# EAGLE design wifiboard (EAGLE 7.5.0)
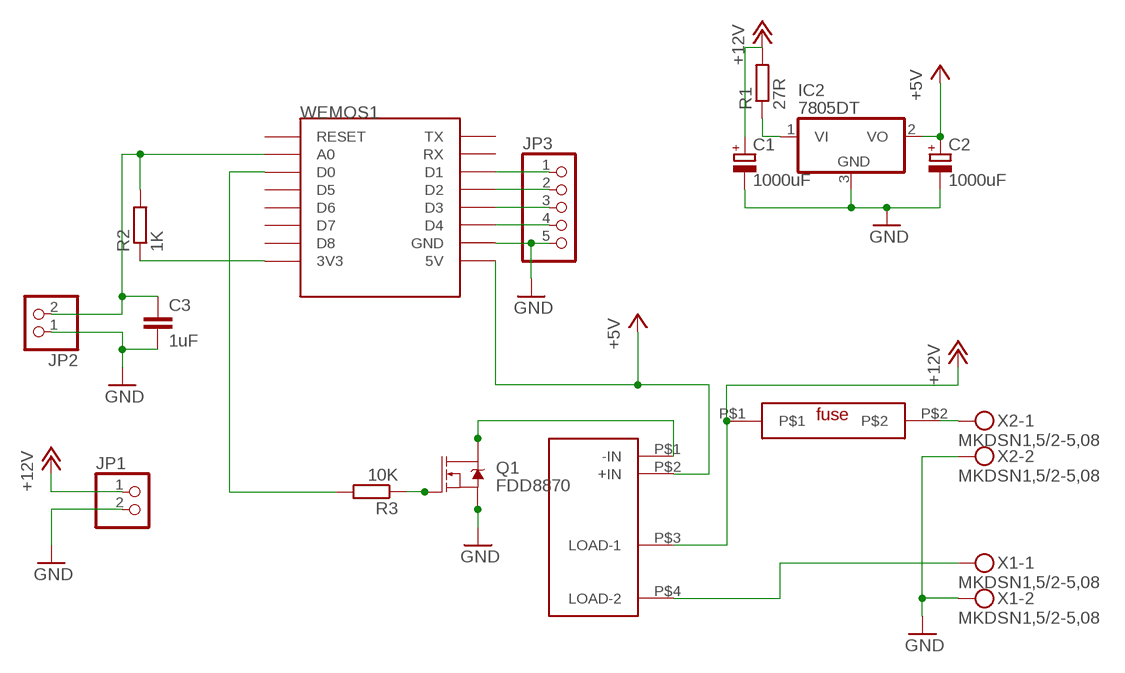
[diagram p0: schematic, sheet 1]

## Parts
C1  1000uF  CPOL-EUB45181B  [B45181B]
C2  1000uF  CPOL-EUB45181B  [B45181B]
C3  1uF  C-EUC0805  [C0805]
IC2  7805DT  [TO252]
JP1  PINHD-1X2  [1X02]
JP2  PINHD-1X2  [1X02]
JP3  PINHD-1X5  [1X05]
Q1  FDD8870  MOSFET-NCH-FDD8780  [DPAK]
R1  27R  R-EU_0207/10  [0207/10]
R2  1K  R-EU_M0805  [M0805]
R3  10K  R-EU_M0805  [M0805]
U$1  OMRON-G6DS  [OMRON-G6DS-1A-H]
U$2  FUSE  [FUSE]
WEMOS1  WEMOS-D1-MINI  [WEMOS-D1-MINI]
X1  MKDSN1,5/2-5,08  [MKDSN1,5/2-5,08]
X2  MKDSN1,5/2-5,08  [MKDSN1,5/2-5,08]

## Nets
+5V: C2.+ IC2.2(VO) U$1.P$2(+IN) WEMOS1.5V
+12V: C1.+ JP1.1 R1.2 U$1.P$3(LOAD-1) U$2.P$1
GND: C1.- C2.- C3.2 IC2.3(GND) JP1.2 JP2.1 JP3.5 Q1.3(S) WEMOS1.GND X1.2 X2.2
N$2: IC2.1(VI) R1.1
N$3: C3.1 JP2.2 R2.2 WEMOS1.A0
N$4: R2.1 WEMOS1.3V3
N$5: Q1.1(G) R3.1
N$6: R3.2 WEMOS1.D0
N$7: Q1.4(D) U$1.P$1(-IN)
N$10: U$1.P$4(LOAD-2) X1.1
N$11: JP3.4 WEMOS1.D4
N$12: U$2.P$2 X2.1
N$13: JP3.3 WEMOS1.D3
N$14: JP3.2 WEMOS1.D2
N$15: JP3.1 WEMOS1.D1
Unconnected: WEMOS1.D5 WEMOS1.D6 WEMOS1.D7 WEMOS1.D8 WEMOS1.RESET WEMOS1.RX WEMOS1.TX

## Library data of the parts
C1 C2 = rcl:CPOL-EU: POLARIZED CAPACITOR, European symbol
C3 = rcl:C-EU: CAPACITOR, European symbol
IC2 = adafruit:78*: Positive VOLTAGE REGULATOR Added bigger pads to the TO-92 package
JP1 JP2 = pinhead:PINHD-1X2: PIN HEADER
JP3 = pinhead:PINHD-1X5: PIN HEADER
Q1 = SparkFun-DiscreteSemi:MOSFET-NCH: N-channel MOSFETs Voltage controlled devices that allow control of high current outputs. SparkFun Products: SparkFun OpenScale <https://www.sparkfun.com/products/13261> SparkFun Digital Sandbox <https://www.sparkfun.com/products/12651> SparkFun Monster Moto Shield <https://www.sparkfun.com/products/10182> SparkFun MOSFET Power Controller <https://www.sparkfun.com/products/11214>; PROD_ID: TRANS-09984; VALUE: 35A/25V/8.5mΩ
R1-R3 = rcl:R-EU_: RESISTOR, European symbol
U$1 = alexa:OMRON-G6DS
U$2 = alexa:FUSE
WEMOS1 = esp8266modules:WEMOS-D1-MINI: WeMos.cc D1 mini ESP8266 module
X1 X2 = con-phoenix-508:MKDSN1,5/2-5,08: MKDSN 1,5/ 2-5,08 Printklemme Nennstrom: 13,5 A Nennspannung: 250 V Rastermaß: 5,08 mm Polzahl: 2 Anschlussart: Schraubanschluss Montage: Löten Anschlussrichtung Leiter/Platine: 0 ° Artikelnummer: 1729128 Source: http://eshop.phoenixcontact.com .. 1729128.pdf

## Board
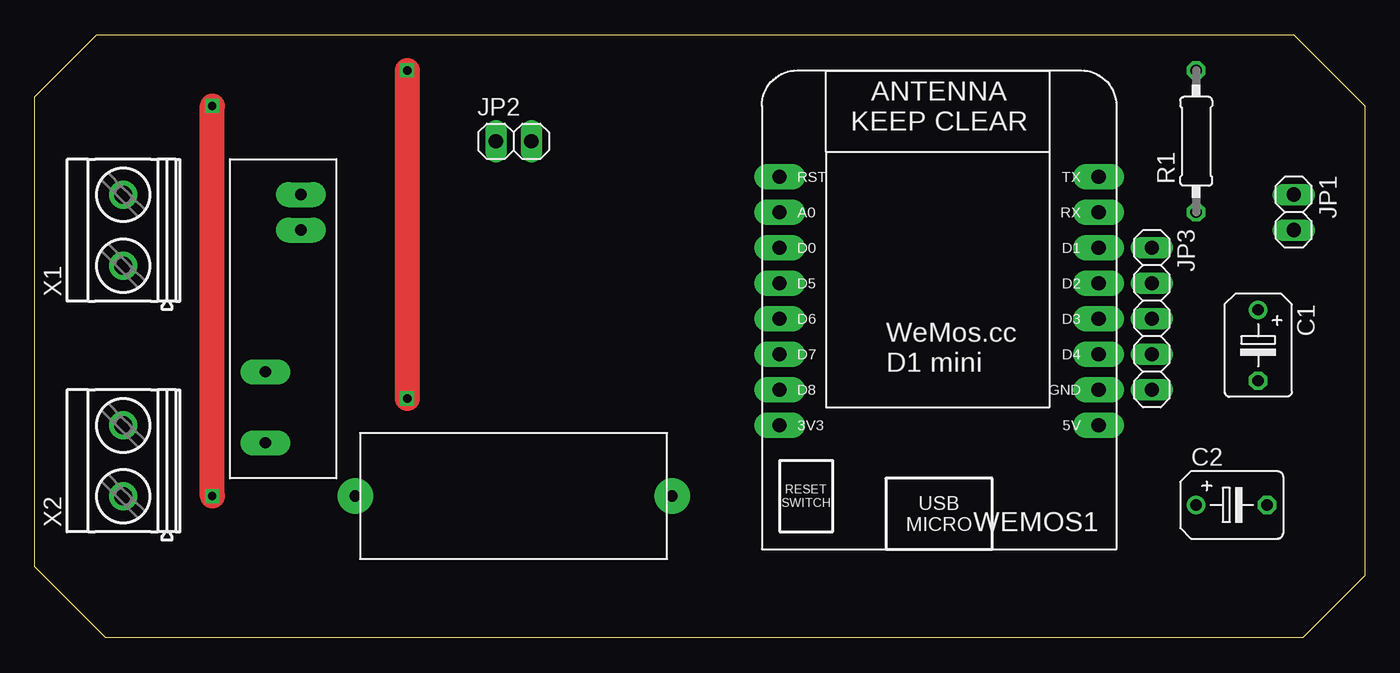
[diagram p1: board, top side]
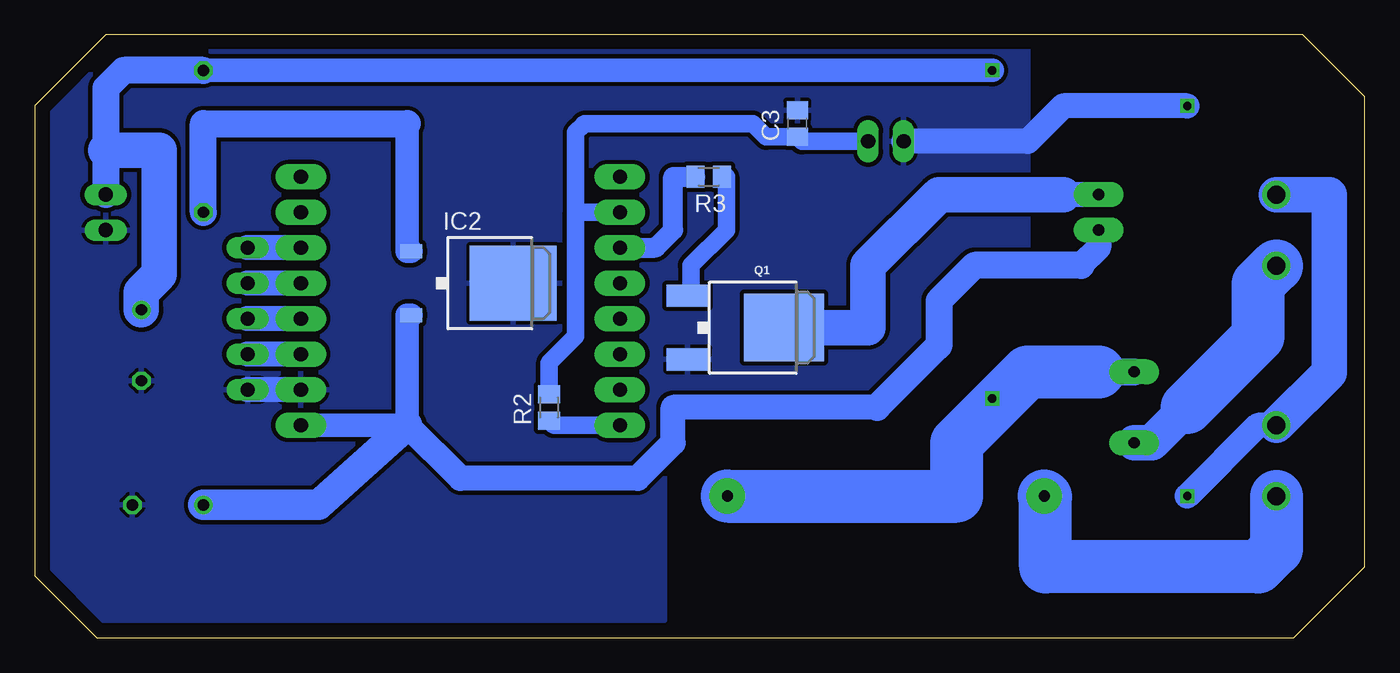
[diagram p2: board, bottom side, seen from below]

Size 95.25 x 43.18 mm. Coordinates in mm from the lower left corner, seen from the top.
Outline: 5.08,0 0,5.08 0,38.74 4.45,43.18 90.17,43.18 95.25,38.1 95.25,4.45 90.81,0 5.08,0
Copper layers (1*16): Top 0.035mm / dielectric 1.5mm / Bottom 0.035mm
Design rules "default *": minimum track width 10mil, minimum drill 24mil, track to track 12mil, track to pad 12mil, pad to pad 12mil, via to via 12mil, smd to smd 8mil, copper to edge 40mil, drill to drill 8mil, minimum pad ring 10mil, minimum via ring 8mil, stop-mask expansion 4mil, vias tented up to drill 0mil, thermal gap 10mil

### Footprints (pad centres in the part's own frame; a part is rotated, then mirrored left to right if it is on the bottom)
B45181B = drill 0.813: + -2.54,0 | drill 0.813 octagon: - 2.54,0
C0805 = smd 1.3 x 1.5: 1 -0.95,0; 2 0.95,0
TO252 = smd 1 x 1.6: 1 -2.28,-4.8; 2 2.28,-4.8 | smd 5.4 x 6.2: 3 0,2.5
1X02 = drill 1.016 long: 1 -1.27,0; 2 1.27,0
1X05 = drill 1.016 long: 1 -5.08,0; 2 -2.54,0; 3 0,0; 4 2.54,0; 5 5.08,0
DPAK = smd 1.6 x 3: 1 -2.28,-5.31; 3 2.28,-5.31 | smd 4.826 x 5.715: 4 0,1.588
0207/10 = drill 0.813 octagon: 1 -5.08,0; 2 5.08,0
M0805 = smd 1.3 x 1.6: 1 -0.95,0; 2 0.95,0
OMRON-G6DS-1A-H = drill 0.8 pad 1.778 long: P$1 0,2.54; P$2 2.54,2.54; P$3 12.7,0; P$4 17.78,0
FUSE = drill 0.8 pad 2.54: P$1 11.35,0; P$2 -11.35,0
WEMOS-D1-MINI = drill 1.016 pad 1.829 long: 3V3 -10.16,-10.16; 5V 12.7,-10.16; A0 -10.16,5.08; D0 -10.16,2.54; D1 12.7,2.54; D2 12.7,0; D3 12.7,-2.54; D4 12.7,-5.08; D5 -10.16,0; D6 -10.16,-2.54; D7 -10.16,-5.08; D8 -10.16,-7.62; GND 12.7,-7.62; RESET -10.16,7.62; RX 12.7,5.08; TX 12.7,7.62
MKDSN1,5/2-5,08 = drill 1.3 pad 2: 1 -2.561,0.025; 2 2.519,0.025

### Placement (x,y rotation side)
C1  87.63,20.95 270 top
C2  85.72,9.53 0 top
C3  40.64,36.83 90 bottom
IC2  63.5,25.4 270 bottom
JP1  90.17,30.48 270 top
JP2  34.29,35.56 0 top
JP3  80.01,22.86 270 top
Q1  43.18,22.22 270 bottom
R1  83.19,35.56 90 top
R2  58.42,16.51 90 bottom
R3  46.99,33.02 180 bottom
U$1  16.51,31.75 270 top
U$2  34.29,10.16 0 top
WEMOS1  63.5,25.4 0 top
X1  6.35,29.21 90 top
X2  6.35,12.7 90 top

### Tracks (layer width: path | path; a pad name or v marks a point on that pad's centre or on a via)
+5V
  Bottom 1.676: WEMOS1.5V 68.58,15.24 68.58,23.12 IC2.2
  Bottom 1.778: 34.92,16.51 49.53,16.51 49.53,13.97 52.07,11.43 64.77,11.43 68.58,15.24 | U$1.P$2 19.05,27.94 20.32,26.67
  Bottom 1.93: 20.32,26.67 27.94,26.67 30.48,24.13 30.48,21.06 arc45 30.55,20.88 34.92,16.51
  Bottom 2.184: C2.+ 74.93,9.53 68.58,15.24
+12V  (via drill 0.6)
  Top 1.778: v26.67,40.64 v26.67,17.14
  Bottom 1.27: v26.67,17.14 26.04,17.14 24.77,18.41
  Bottom 1.676: v26.67,40.64 R1.2
  Bottom 1.93: 19.05,19.05 U$1.P$3 | R1.2 88.8,40.64 arc-45 88.97,40.57 90.17,39.37 90.17,34.93 JP1.1
  Bottom 2.54: C1.+ 87.63,24.77 86.36,26.04 86.36,34.93 90.17,34.93
  Bottom 3.81: U$2.P$1 29.21,10.16 29.21,13.97 24.77,18.41 24.13,19.05 19.05,19.05
GND  (via drill 0.6)
  Top 1.778: v12.7,10.16 v12.7,38.1
  Bottom 1.778: WEMOS1.GND JP3.5 | X2.2 7.64,15.22 v12.7,10.16 | v12.7,38.1 21.59,38.1 24.13,35.56 JP2.1
  Bottom 2.54: X1.2 2.56,31.73 2.54,31.75 2.54,19 X2.2
  pour Bottom: 50.16,1.27 93.98,1.27 93.98,43.18 24.13,43.18 24.13,27.94 26.67,25.4 29.21,24.13 34.29,16.51 50.16,16.51
N$2
  Bottom 1.676: IC2.1 68.58,27.68 68.58,36.83
  Bottom 1.93: R1.1 83.19,36.83 68.58,36.83
N$3
  Bottom 1.27: R2.2 58.42,19.58 arc45 58.35,19.76 56.52,21.59 56.52,30.48 | 56.52,30.48 WEMOS1.A0 | 56.52,30.48 56.52,36.2 55.95,36.76 arc45 55.77,36.83 43.81,36.83 42.87,35.88 C3.1 40.32,35.56 JP2.2
N$4
  Bottom 1.27: WEMOS1.3V3 57.99,15.24 arc45 58.17,15.31 R2.1
N$5
  Bottom 1.27: R3.1 45.72,33.02 45.72,29.21 48.26,26.67 48.26,24.73 Q1.1
N$6
  Bottom 1.422: WEMOS1.D0 50.91,27.94 arc-45 50.73,28.01 49.53,29.21 49.53,33.02 R3.2
N$7
  Bottom 1.778: U$1.P$1 21.59,31.75
  Bottom 2.54: 21.59,31.75 30.38,31.75 arc-45 30.55,31.68 35.56,26.67 35.56,22.22 Q1.4
N$10
  Bottom 2.54: U$1.P$4 15.24,13.97 12.7,16.51
  Bottom 3.81: 12.7,16.51 7.62,21.59 7.62,25.35 X1.1
N$11
  Bottom 1.778: WEMOS1.D4 JP3.4
N$12
  Bottom 3.81: X2.1 6.33,6.38 7.62,5.08 22.86,5.08 22.86,10.08 U$2.P$2
N$13
  Bottom 1.778: WEMOS1.D3 JP3.3
N$14
  Bottom 1.778: WEMOS1.D2 JP3.2
N$15
  Bottom 1.778: WEMOS1.D1 JP3.1